# Altium schematic sheet Gain Control.SchDoc
size Letter; SheetNumber: 12; SheetTotal: 14; SPICEModelCacheHADLSIVX: <root> / <DocumentId>HADLSIVX</DocumentId> / <CacheFrame Number="0"> / <Model Name="4305rms" Kind="CKT"> / <Text>* / * / *THAT4305 RMS MACROMODEL / *REV 00 6-24-2014 / *CONNECTIONS: / *	        input current / *		|      timing capacitor / *		|      |  output voltage / *		|      |  |       ground / *		|      |  |       |   negative power supply / *		|      |  |       |   |  positive power supply / *		|      |  |       |   |  | / .SUBCKT 4305RMS RMS_IN CT RMS_OUT GND V- V+ / * / Q_Q6         2 1 RMS_IN QPNPRMS / Q_Q10        3 3 4 QPNPRMS / F_F5         CT V- VF_F5 1 / VF_F5        5 V- 0V / F_F3         6 V- VF_F3 1 / VF_F3        2 V- 0V / F_F4         V+ 7 VF_F4 1 / VF_F4        V+ 6 0V / I_I1         8 V- DC 3.2uA / F_F2         V+ 2 VF_F2 1 / VF_F2        V+ 9 0V / Q_Q9         V+ 0 4 QNPNRMS / Q_Q3         9 10 RMS_IN QNPNRMS / E_E1         V+ 10 V+ 11 1 / G_G1         11 0 12 13 6.154e-6 / R_R1         0 11  22Meg / I_I2         14 5 DC 7.5uA / Q_Q1         13 RMS_IN 8 QNPNRMS 1 / R_R4         12 V+  162.5k / R_R3         13 V+  162.5k / C_C1         0 11  4pF / E_E2         10 1 0 3 1 / E_E3         15 16 V+ 14 1 / E_E5         RMS_OUT 15 CT 15 1 / Q_Q2         12 GND 8 QNPNRMS 1 / E_E6         15 0 GND 0 1 / Q_Q4         7 17 18 QNPNRMS 4 / Q_Q7         19 16 18 QPNPRMS 4 / Q_Q5         14 14 V+ QPNPRMS 4 / R_R6         17 7  700 / R_R7         19 16  700 / E_E4         20 15 7 15 1 / Q_Q8         V+ 20 CT QNPNRMS 4 / I_I4         3 V- DC 40nA / I_I5	     V+ V- 370uA / .MODEL QNPNRMS NPN IS=1e-15 BF=200 VAF=800 CJC=.19pF RB=220 / .MODEL QPNPRMS PNP IS=1e-15 BF=75 VAF=80 CJC=.53pF RB=205 / .ENDS</Text> / </Model> / <Model Name="4305vca" Kind="CKT"> / <Text>* / * / *THAT4305 VCA MACROMODEL / *REV 00 6-24-2014 / *CONNECTIONS: / *	        input current / *		|      output current / *		|      |       negative control voltage / *		|      |       |   positive control voltage / *		|      |       |   |   positive power supply / *		|      |       |   |   |  negative power supply / *		|      |       |   |   |  |  ground / *		|      |       |   |   |  |  | / .SUBCKT 4305VCA VCA_IN VCA_OUT EC- EC+ V+ V- GND / * / R_R11        22 20  30 / R_R9         EC+ 34  30 / Q_Q35        20 22 24 QNPNVCA / Q_Q42        30 30 31 QNPNVCA / V_V6         1 2 DC 1.4V / D_D5         1 V+ DNOM / Q_Q43        0 0 31 QPNPVCA / Q_Q33        12 9 10 QNHIB / V_V7         2 3 DC .7V / I_I1         10 V- DC 7.0uA / G_G7         28 V- 40 V- 100e-6 / E_E1         20 28 30 0 2 / Q_Q39        28 28 27 QPNPVCA / Q_Q36        VCA_OUT 34 27 QNPNVCA / R_R36        V- 28  100Meg / Q_Q38        28 28 26 QPNPVCA / I_I9         20 28 DC 130uA / Q_Q41        VCA_OUT EC- 24 QPNPVCA / V_V5         GND 40 DC 1.8V / R_R10        EC- 25  30 / V_Vos        9 GND DC 3mV / D_D6         GND 3 DNOM / C_C3         20 0  4.7pF / R_R12        21 20  30 / G_G5         V+ 2 11 12 33.65e-6 / R_R35        12 V+  15k / R_R34        11 V+  15k / R_R29        GND 2  25Meg / G_G6         V+ 20 2 GND 2.3e-3 / C_C4         GND 2 16pF / Q_Q37        20 21 23 QNPNVCA / I_I8         28 V- DC 950uA / I_I10        V+ 6 DC 100uA / D_D7         6 V- DNOM / I_I11        V+ 7 DC 100uA / D_D8         7 V- DNOM / Q_Q40        VCA_IN EC+ 23 QPNPVCA / Q_Q34        VCA_IN 25 26 QNPNVCA / Q_Q32        11 VCA_IN 10 QNHIB / G_G8         VCA_IN V- 6 7 40e-5 / I_I2         0 30 DC 22uA / I_Isym       0 34 DC 4.4uA / V_V9	     V+ 4 2.8V / R_R40	     4 V- 40k / .model DNOM D Is=1e-14 Cjo=.1pF Rs=.1 / .model QNHIB NPN BF=2000 / .model QNPNVCA NPN IS=5e-16 BF=150 VAF=150 RB=45 CJC=1.0pF / .model QPNPVCA PNP IS=5e-16 BF=75 VAF=100 RB=100 CJC=1.1pF / .ENDS</Text> / </Model> / <Model Name="that4305" Kind="CKT"> / <Text>* / * This information is protected under the United States copyright / * laws. THAT Corporation ("THAT") hereby grants users of this / * macromodel (the "User"), a nonexclusive, nontransferable / * license to use this macromodel as long as the licensee abides / * by the terms of this agreement.  Before using the macromodel, / * the User should read this license.  If the User does not accept / * these terms, the macromodel contained herein should be erased, / * destroyed or returned to THAT within 30 days. / * / * The User may copy and distribute, at no charge, verbatim copies / * of the Macromodel as contained herein, in any medium, provided / * that the User conspicuously publishes on each copy this copyright / * notice and disclaimer of warranty.  The User may modify this / * macromodel to suit his or her specific applications, and the User / * may make copies of the modified macromodel for use within his or / * her company only, and provided the modified files carry prominent / * notices stating that the files have been changed, and the date of / * any changes. / * / * This macromodel is provided "AS IS, WHERE IS, AND WITH NO WARRANTY / * OF ANY KIND EITHER EXPRESSED OR IMPLIED, INCLUDING BUT NOT LIMITED / * TO ANY IMPLIED WARRANTIES OF MERCHANTABILITY AND FITNESS FOR A / * PARTICULAR PURPOSE."  In no event will THAT be liable for special, / * collateral, incidental, or consequential damages in connection / * with or arising out of the use of this macromodel.  THAT reserves / * the right to make changes to the products and macromodel without / * prior notice. / * / *THAT4305 MACROMODEL / *REV 02 6-1-2017 / *All in one subcircuit. replaces VCC and VEE by V+ and V-, respectively: / .SUBCKT THAT4305 RMS_IN CT RMS_OUT GND V- V+ VCA_IN VCA_OUT EC- EC+ / X_X1      RMS_IN CT RMS_OUT GND V- V+ 4305RMS / X_X2      VCA_IN VCA_OUT EC- EC+ V+ V- GND 4305VCA / .ENDS</Text> / <Dependency>0\4305rms</Dependency> / <Dependency>0\4305vca</Dependency> / </Model> / </CacheFrame> / </root>
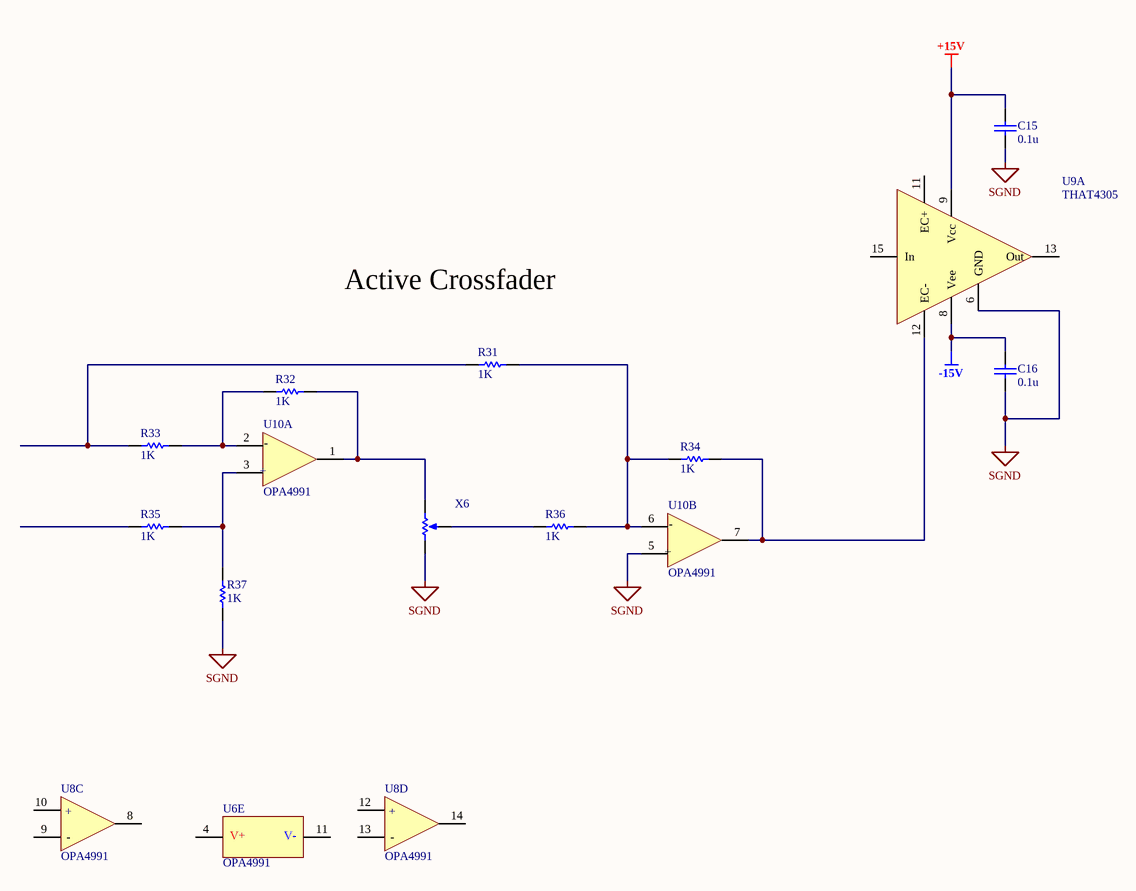
[diagram p0: Gain Control.SchDoc]

## Parts
C15  value 0.1u  (hidden comment: Capacitor)
C16  value 0.1u  (hidden comment: Capacitor)
R31  value 1K  (hidden comment: Resistor)
R32  value 1K  (hidden comment: Resistor)
R33  value 1K  (hidden comment: Resistor)
R34  value 1K  (hidden comment: Resistor)
R35  value 1K  (hidden comment: Resistor)
R36  value 1K  (hidden comment: Resistor)
R37  value 1K  (hidden comment: Resistor)
U6  OPA4991  [FP-D0014A-IPC_B]  (part E of 5)
U8  OPA4991  [FP-D0014A-IPC_B]  (parts C,D of 5)
U9  THAT4305  [QSOP-16]  (part A of 2)
U10  OPA4991  [FP-D0014A-IPC_B]  (parts A,B of 5)
X6  Potentiometer  (value not drawn)

## Nets
+15V: C15.2 U9.9(Vcc)
-15V: C16.2 U9.8(Vee)
SGND: C15.1 C16.1 R37.1 U9.6(GND) U10.5(IN2+) X6.1(TOP)
NetR31_1: R31.1 R33.1
NetR31_2: R31.2 R34.1 R36.2 U10.6(IN2-)
NetR32_1: R32.1 R33.2 U10.2(IN1-)
NetR32_2: R32.2 U10.1(OUT1) X6.2(BOT)
NetR34_2: R34.2 U9.12(EC-) U10.7(OUT2)
NetR35_2: R35.2 R37.2 U10.3(IN1+)
NetR36_1: R36.1 X6.3(TAP)

Not connected (* = marked no-connect by the designer): R35 1; U6 4(V+) 11(V-); U8 8(OUT3) 9(IN3-) 10(IN3+) 12(IN4+) 13(IN4-) 14(OUT4); U9 11(EC+) 13(Out) 15(In)

## Notes on the sheet
- Active Crossfader
- (in symbol OPA4991IDR, part A) -; +
- (in symbol OPA4991IDR, part B) -; +
- (in symbol OPA4991IDR, part C) +; -
- (in symbol OPA4991IDR, part D) +; -

## Library data of the parts
C15 C16 = Capacitor: SimulationGenericComponent: True
R31-R37 = Resistor: TC1: 0; SimulationGenericComponent: True; TC2: 0
U6 U8 U10 = OPA4991IDR: 40-V, DUAL 4.5MHZ, RAIL-TO-RAIL
U9 = 4305Q16-U: Pre-trimmed Analog Engine® Dynamics Processor IC
X6 = Potentiometer: value: 1k; position: 0.5; SimulationGenericComponent: True